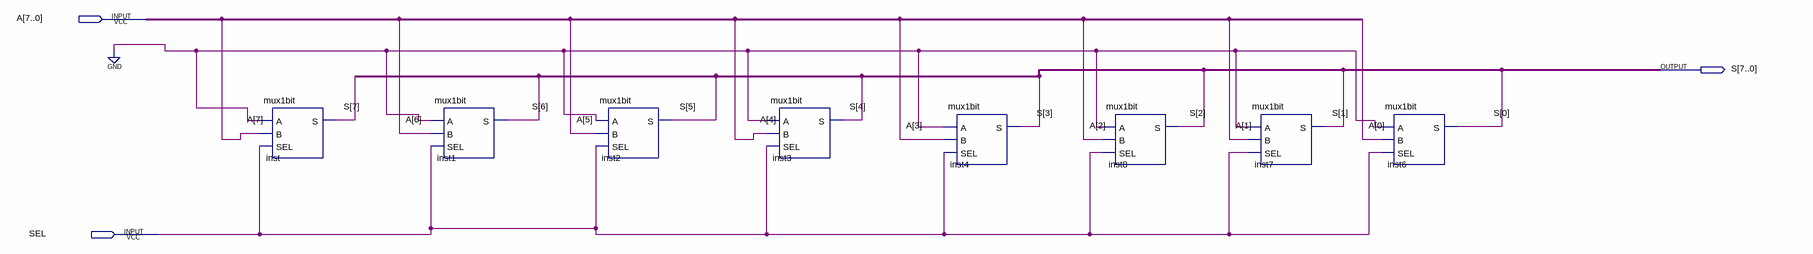
[diagram p0: schematic sheet]
// Quartus schematic mux8bitSaida.bdf as structural Verilog: 8 symbols, 3 pins
module mux8bitSaida (
  input  [7:0] A,
  input  SEL,
  output [7:0] S
);

  mux1bit inst (.A(1'b0), .B(A[7]), .SEL(SEL), .S(S[7]));
  mux1bit inst1 (.A(1'b0), .B(A[6]), .SEL(SEL), .S(S[6]));
  mux1bit inst2 (.A(1'b0), .B(A[5]), .SEL(SEL), .S(S[5]));
  mux1bit inst3 (.A(1'b0), .B(A[4]), .SEL(SEL), .S(S[4]));
  mux1bit inst4 (.A(1'b0), .B(A[3]), .SEL(SEL), .S(S[3]));
  mux1bit inst8 (.A(1'b0), .B(A[2]), .SEL(SEL), .S(S[2]));
  mux1bit inst7 (.A(1'b0), .B(A[1]), .SEL(SEL), .S(S[1]));
  mux1bit inst6 (.A(1'b0), .B(A[0]), .SEL(SEL), .S(S[0]));
endmodule
